# EAGLE schematic Schaltplan (EAGLE 6.5.0)
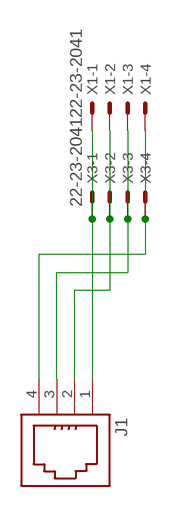
[diagram p0: schematic, sheet 1]

## Parts
J1  615004143821  [615004143821]
X1  22-23-2041  [22-23-2041]
X3  22-23-2041  [22-23-2041]

## Nets
N$1: J1.1 X1.1 X3.1
N$2: J1.2 X1.2 X3.2
N$3: J1.3 X1.3 X3.3
N$4: J1.4 X1.4 X3.4

## Library data of the parts
J1 = InputOutputIO (rev18b):615004143821: WR-MJ Horizontal Plastic 4P4C Modular Jack Tab Up, 4 Pins=>Code : Con_I-O_MJ-H_Plastic_Up_615004143821 <http://katalog.we-online.de/media/images/eican/Con_I-O_MJ-H_Plastic_Up_615004143821_pf2.jpg> Details see: http://katalog.we-online.de/en/em/MJ_HORIZONTAL_PLASTIC_4P4C_TAB_UP Created 2014-07-10, Karrer Zheng 2014 (C) Würth Elektronik
X1 X3 = con-molex:22-23-2041: .100" (2.54mm) Center Header - 4 Pin; MF: MOLEX; MPN: 22-23-2041; OC_FARNELL: 1462920; OC_NEWARK: 38C0355